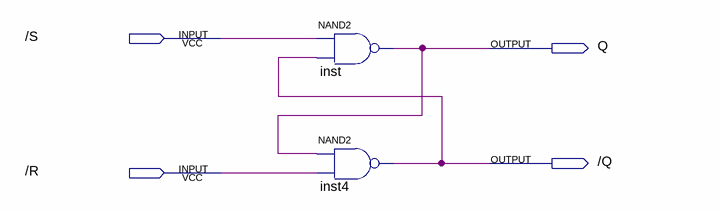
[diagram p0: schematic sheet]
// Quartus schematic Debouce.bdf as structural Verilog: 2 symbols, 4 pins
module Debouce (
  input  \/S ,
  input  \/R ,
  output Q,
  output \/Q 
);

  nand inst (Q, \/S , \/Q );
  nand inst4 (\/Q , Q, \/R );
endmodule
